# Altium schematic sheet MCU.SchDoc
size A; SheetNumber: 2; SheetTotal: 5; SPICEModelCacheIKGZLCJW: <root> / <DocumentId>IKGZLCJW</DocumentId> / <CacheFrame Number="0"> / <Model Name="gmk105bj104_v-f" Kind="CKT"> / <Text>* GMK105BJ104_V-F     SPICE MODEL  ( General Type ) / *-------------------------------------------------------------------------------------------------------- / * Model Generated by TAIYO YUDEN Corporation (http://www.ty-top.com) / * Version 1.0 / * TAIYO YUDEN Control No. 170508_061226 / * Copyright(c) 2012 TAIYO YUDEN CO.,LTD. All Rights Reserved. / *-------------------------------------------------------------------------------------------------------- / * / * Products Name : Multilayer Ceramic Capacitors / * / * Characteristics : / *     Capacitance : 0.1 uF , Rated Voltage : 35V , TCC : B / X5R / *     Case Size : 1.0 x 0.5 / 0.039 x 0.02 [mm/inch] , Thickness : 0.5 / 0.02 [mm/inch] / *     (Conditions: Temperature = 25 degC , DC Bias Current/Voltage = 0A / 0V) / * / * Frequency Range : 40Hz - 3GHz / * / * External Node Assignments : / * / *  1  o---| |---o  2 / * / *-------------------------------------------------------------------------------------------------------- / .SubCkt GMK105BJ104_V-F 1 2 / **************************** / C0 1 110 0.070351u / Cm 1 101 0.016111u / C1 101 102 0.069296u / Rc1 101 102 16.146k / C2 102 103 0.030776u / Rc2 102 103 344.14 / C3 103 110 0.021195u / Rc3 103 110 5.1627 / C2m 1 301 0.020847u / C21 301 302 0.28927u / Rc21 301 302 15.286k / C22 302 303 0.26628u / Rc22 302 303 12.239k / C23 303 304 0.21132u / Rc23 303 304 15.145k / C24 304 305 0.078855u / Rc24 304 305 2.6688k / C25 305 306 0.20986u / Rc25 305 306 330.59 / C26 306 307 0.078155u / Rc26 306 307 723.11 / C27 307 308 0.029921u / Rc27 307 308 64.708 / C28 308 309 0.019548u / Rc28 308 309 24.402 / C29 309 110 1666p / Rc29 309 110 0.83666 / Rp0 1 110 5G / L0 110 120 0.25789n / Lm 120 130 0.093457n / L1 120 121 1.1632p / RL1 121 130 0.63209 / L2 120 122 2.3124p / RL2 122 130 1.1301 / L3 120 123 6.01p / RL3 123 130 4.6768 / CR 120 124 0.022616u / LR 124 125 0.050216n / RR 125 130 0.12272 / CL 130 140 1.7584p / LL 130 140 0.19044n / RL 130 140 98.661 / Rs 140 2 25.54m / **************************** / .ends GMK105BJ104_V-F</Text> / </Model> / </CacheFrame> / </root>
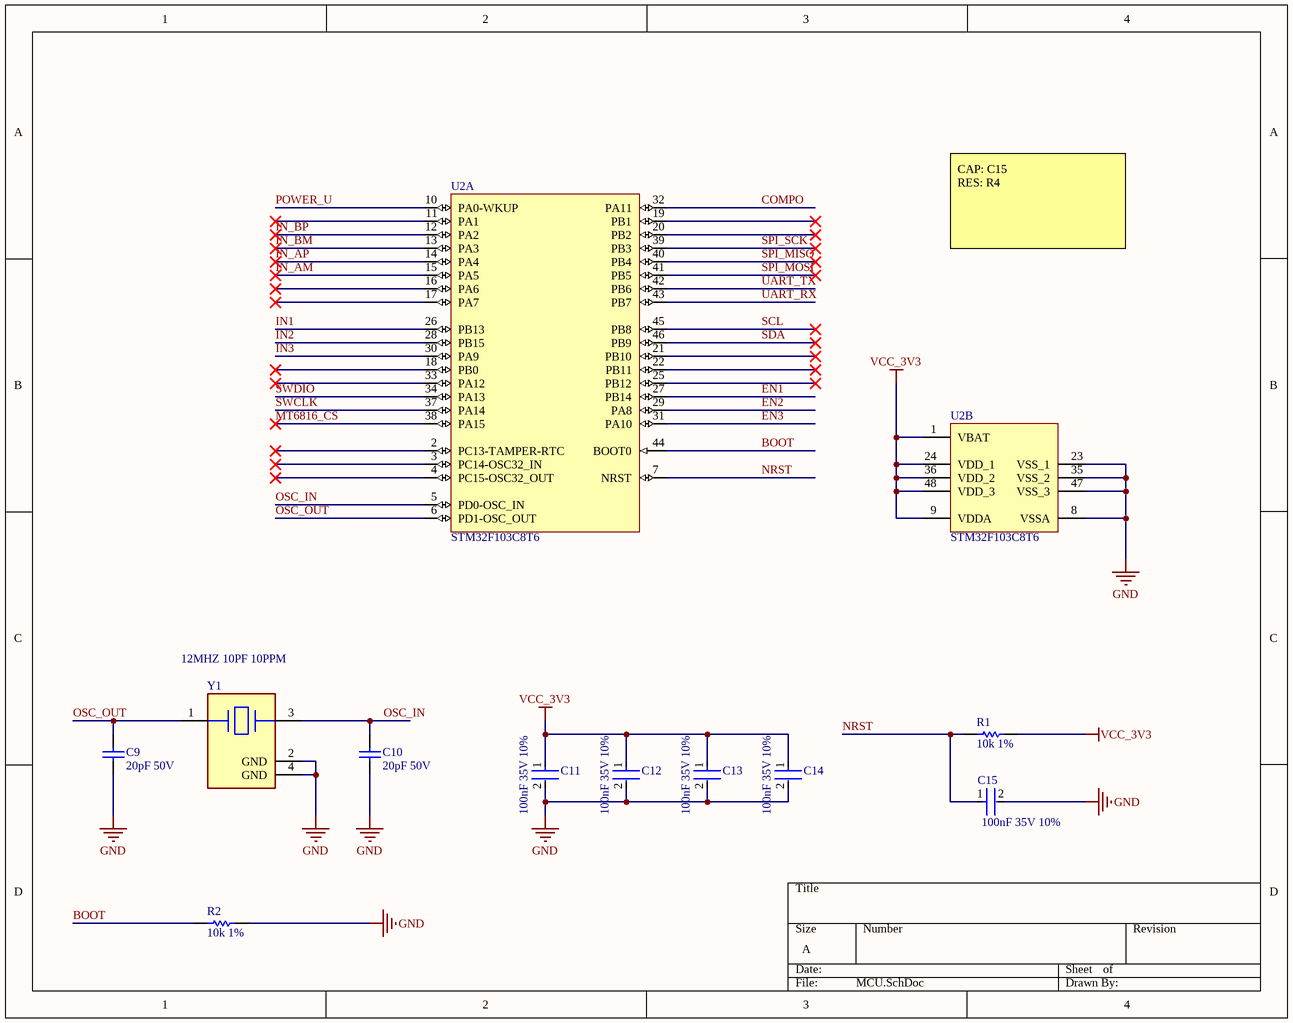
[diagram p0: MCU.SchDoc]

## Parts
C9  20pF 50V  [CAPC1608X90X30LL10T20]
C10  20pF 50V  [CAPC1608X90X30LL10T20]
C11  100nF 35V 10%  [FP-0402-L_1_0_0_05-W_0_5-IPC_A]
C12  100nF 35V 10%  [FP-0402-L_1_0_0_05-W_0_5-IPC_A]
C13  100nF 35V 10%  [FP-0402-L_1_0_0_05-W_0_5-IPC_A]
C14  100nF 35V 10%  [FP-0402-L_1_0_0_05-W_0_5-IPC_A]
C15  100nF 35V 10%  [FP-0402-L_1_0_0_05-W_0_5-IPC_A]
R1  10k 1%  [RESC2013X70X40ML20T20]
R2  10k 1%  [RESC2013X70X40ML20T20]
U2  STM32F103C8T6  [STM-LQFP48_L]  (parts A,B of 2)
Y1  12MHZ 10PF 10PPM  [FP-ABM3B-MFG]

## Nets
GND: C9.1 C10.1 C11.2 C12.2 C13.2 C14.2 C15.2 R2.2 U2.8(VSSA) U2.23(VSS_1) U2.35(VSS_2) U2.47(VSS_3) Y1.2(GND) Y1.4(GND)
VCC_3V3: C11.1 C12.1 C13.1 C14.1 R1.2 U2.1(VBAT) U2.9(VDDA) U2.24(VDD_1) U2.36(VDD_2) U2.48(VDD_3)
BOOT: R2.1 U2.44(BOOT0)
COMPO: U2.32(PA11)
EN1: U2.27(PB14)
EN2: U2.29(PA8)
EN3: U2.31(PA10)
IN1: U2.26(PB13)
IN2: U2.28(PB15)
IN3: U2.30(PA9)
IN_AM: U2.15(PA5)
IN_AP: U2.14(PA4)
IN_BM: U2.13(PA3)
IN_BP: U2.12(PA2)
MT6816_CS: U2.38(PA15)
NRST: C15.1 R1.1 U2.7(NRST)
OSC_IN: C10.2 U2.5(PD0-OSC_IN) Y1.3
OSC_OUT: C9.2 U2.6(PD1-OSC_OUT) Y1.1
POWER_U: U2.10(PA0-WKUP)
SCL: U2.45(PB8)
SDA: U2.46(PB9)
SPI_MISO: U2.40(PB4)
SPI_MOSI: U2.41(PB5)
SPI_SCK: U2.39(PB3)
SWCLK: U2.37(PA14)
SWDIO: U2.34(PA13)
UART_RX: U2.43(PB7)
UART_TX: U2.42(PB6)

Not connected (* = marked no-connect by the designer): U2 2(PC13-TAMPER-RTC)* 3(PC14-OSC32_IN)* 4(PC15-OSC32_OUT)* 11(PA1)* 16(PA6)* 17(PA7)* 18(PB0)* 19(PB1)* 20(PB2)* 21(PB10)* 22(PB11)* 25(PB12)* 33(PA12)*

## Notes on the sheet
- CAP: C15
  RES: R4

## Library data of the parts
C9 C10 = CMP-2000-06100-1: Chip Capacitor, 20 pF, +/- 5%, 50 V, -55 to 85 degC, 0603 (1608 Metric), RoHS, Tape and Reel; Manufacturer: Samsung Electro-Mechanics; Dielectric: C0G; Tolerance (%): ±5%; Case Size/Dimension: 0603; Datasheet Version: 06/2016; Rated Voltage: 50V; Manufacturer URL: http://www.samsungsem.com/global/index.jsp; Capacitance: 20pF; Datasheet URL: http://www.samsungsem.com/kr/support/product-search/mlcc/__icsFiles/afieldfile/2016/08/18/S_CL10C200JB8NNNC.pdf; Mounting Technology: SurfaceMount; Package Description: 2-Pin Surface Mount Device, Body 1.60 x 0.80 mm; Package Reference: 0603
C11-C15 = CMP-2000-06323-3: Dielectric: X5R; Voltage: 35V; Voltage Rating: 35V; Halogen Free: Halogen Free; Mount: Surface Mount; Max Operating Temperature: 85°C; Width: 0.02inch; Tolerance: 10%; Min Operating Temperature: -55°C; Length: 1mm; REACH SVHC: No SVHC; Voltage Rating (DC): 35V; Resistor Type: Ceramic; Radiation Hardening: No; Series: M; Termination: SMD/SMT; RoHS Compliant: Yes; Case/Package: 0402; Height: 0.5mm; Packaging: Tape and Reel; Construction: Flat; Capacitance: 100nF; Case Code (Metric): 1005; Case Code (Imperial): 0402; Depth: 0.5mm; Number of Pins: 2; Package Quantity: 1; Thickness: 0.022inch
R1 R2 = CMP-2001-04376-1: Manufacturer: Panasonic; Part Number: ERJ-6ENF1002V
U2 = CMP-0237-00215-3: ARM Cortex-M3 32-bit MCU, 64 KB Flash, 20 KB Internal RAM, 37 I/Os, 48-pin LQFP, -40 to 85 degC, Tray; Supply Voltage(Vcc) min (V): 2; Internal RAM Size (kB): 20; FLASH Size (Prog) (kB): 64; A/D Converter: 2x12-bit (10 Channel); I/Os (High Current): 37; Operating Frequency(F) (Processor speed) (MHz): 72; Core: ARM Cortex-M3; ComponentLink3Description: Package Specification; Mounting Technology: Surface Mount; PartNumber: STM32F103C8T6; PackageReference: LQFP48; Packing: Tray; ComponentLink3URL: http://www.st.com/st-web-ui/static/active/en/resource/technical/document/datasheet/DM00058181.pdf; DatasheetVersion: Rev. 16; ComponentLink1URL: http://www.st.com/web/en/home.html; PackageVersion: Rev. 6, 06/2013; ComponentLink2URL: http://www.st.com/st-web-ui/static/active/en/resource/technical/document/datasheet/CD00161566.pdf; ComponentLink1Description: Manufacturer URL; ComponentLink2Description: Datasheet; PackageDescription: 48-Pin Low Profile Quad Flat Package, 7 x 7 mm Body, 0.5 mm Pitch
Y1 = CMP-27762-011386-1: Crystal 12MHz ±10ppm 10pF SMD-4 5mm x 3.2mm; ESR (Equivalent Series Resistance): 70R; Resistor Type: Ceramic; Width: 0.126inch; Max Operating Temperature: 60°C; Series: ABM3B; Load Capacitance: 10pF; Package Quantity: 1000; Tolerance: 10ppm; Termination: SMD/SMT; Lead Free: Lead Free; Operating Frequency: 12 MHz; Number of Pins: 4; Case/Package: CSMD; Min Operating Temperature: -10°C; Packaging: Tape and Reel; Frequency Stability: 10ppm; Frequency: 12MHz; Height: 0.043inch; Depth: 3.2mm; Series Resistance: 70R; REACH SVHC: No SVHC; Length: 5mm; Mount: Surface Mount; Frequency Tolerance: 10ppm